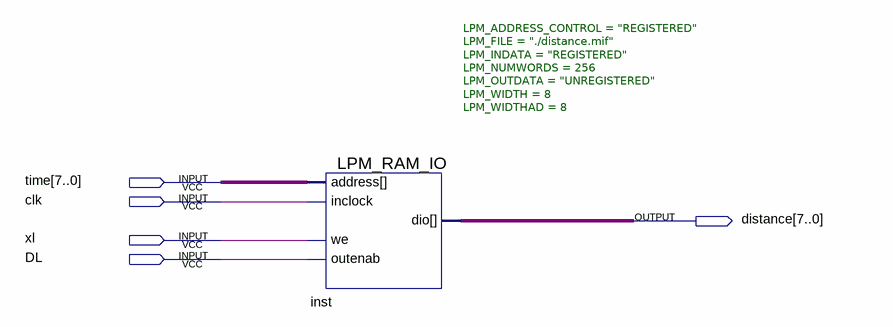
[diagram p0: schematic sheet]
// Quartus schematic distance1.bdf as structural Verilog: 1 symbols, 5 pins
module distance1 (
  input  [7:0] \time ,
  input  clk,
  input  xl,
  input  DL,
  output [7:0] distance
);

  LPM_RAM_IO #(.LPM_ADDRESS_CONTROL("REGISTERED"), .LPM_FILE("./distance.mif"), .LPM_INDATA("REGISTERED"), .LPM_NUMWORDS(256), .LPM_OUTDATA("UNREGISTERED"), .LPM_WIDTH(8), .LPM_WIDTHAD(8)) inst (
    .address(\time ), .inclock(clk), .we(xl), .outenab(DL), .dio(distance));
endmodule
